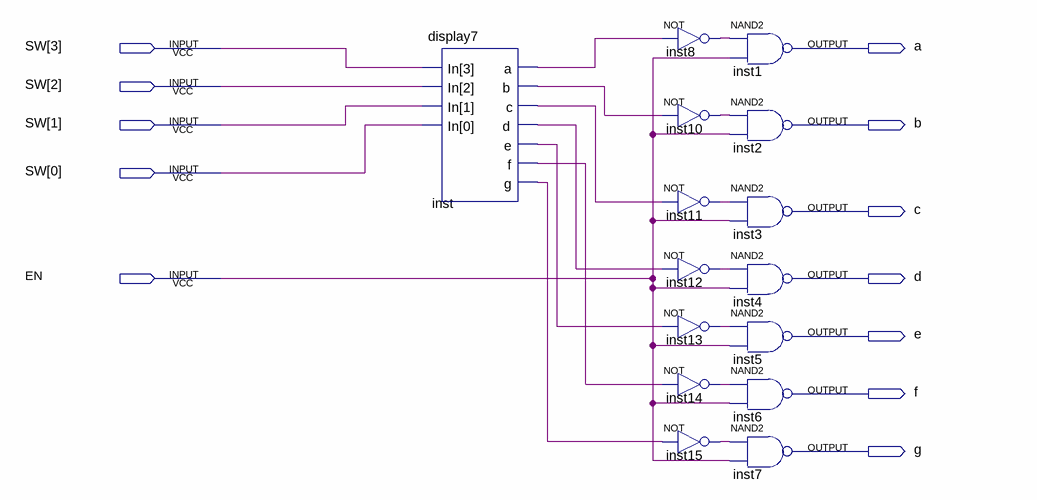
[diagram p0: schematic sheet]
// Quartus schematic display7_en.bdf as structural Verilog: 15 symbols, 12 pins
module display7_en (
  input  [3:0] SW,
  input  EN,
  output a,
  output b,
  output c,
  output d,
  output e,
  output f,
  output g
);

  wire inst8_out, inst10_out, inst11_out, inst12_out, inst13_out, inst14_out, inst15_out, inst_a, inst_b,
       inst_c, inst_d, inst_e, inst_f, inst_g;

  display7 inst (.In(SW), .a(inst_a), .b(inst_b), .c(inst_c), .d(inst_d), .e(inst_e), .f(inst_f), .g(inst_g));
  not inst8 (inst8_out, inst_a);
  not inst10 (inst10_out, inst_b);
  not inst11 (inst11_out, inst_c);
  not inst12 (inst12_out, inst_d);
  not inst13 (inst13_out, inst_e);
  not inst14 (inst14_out, inst_f);
  not inst15 (inst15_out, inst_g);
  nand inst1 (a, inst8_out, EN);
  nand inst2 (b, inst10_out, EN);
  nand inst3 (c, inst11_out, EN);
  nand inst4 (d, inst12_out, EN);
  nand inst5 (e, inst13_out, EN);
  nand inst6 (f, inst14_out, EN);
  nand inst7 (g, inst15_out, EN);
endmodule
